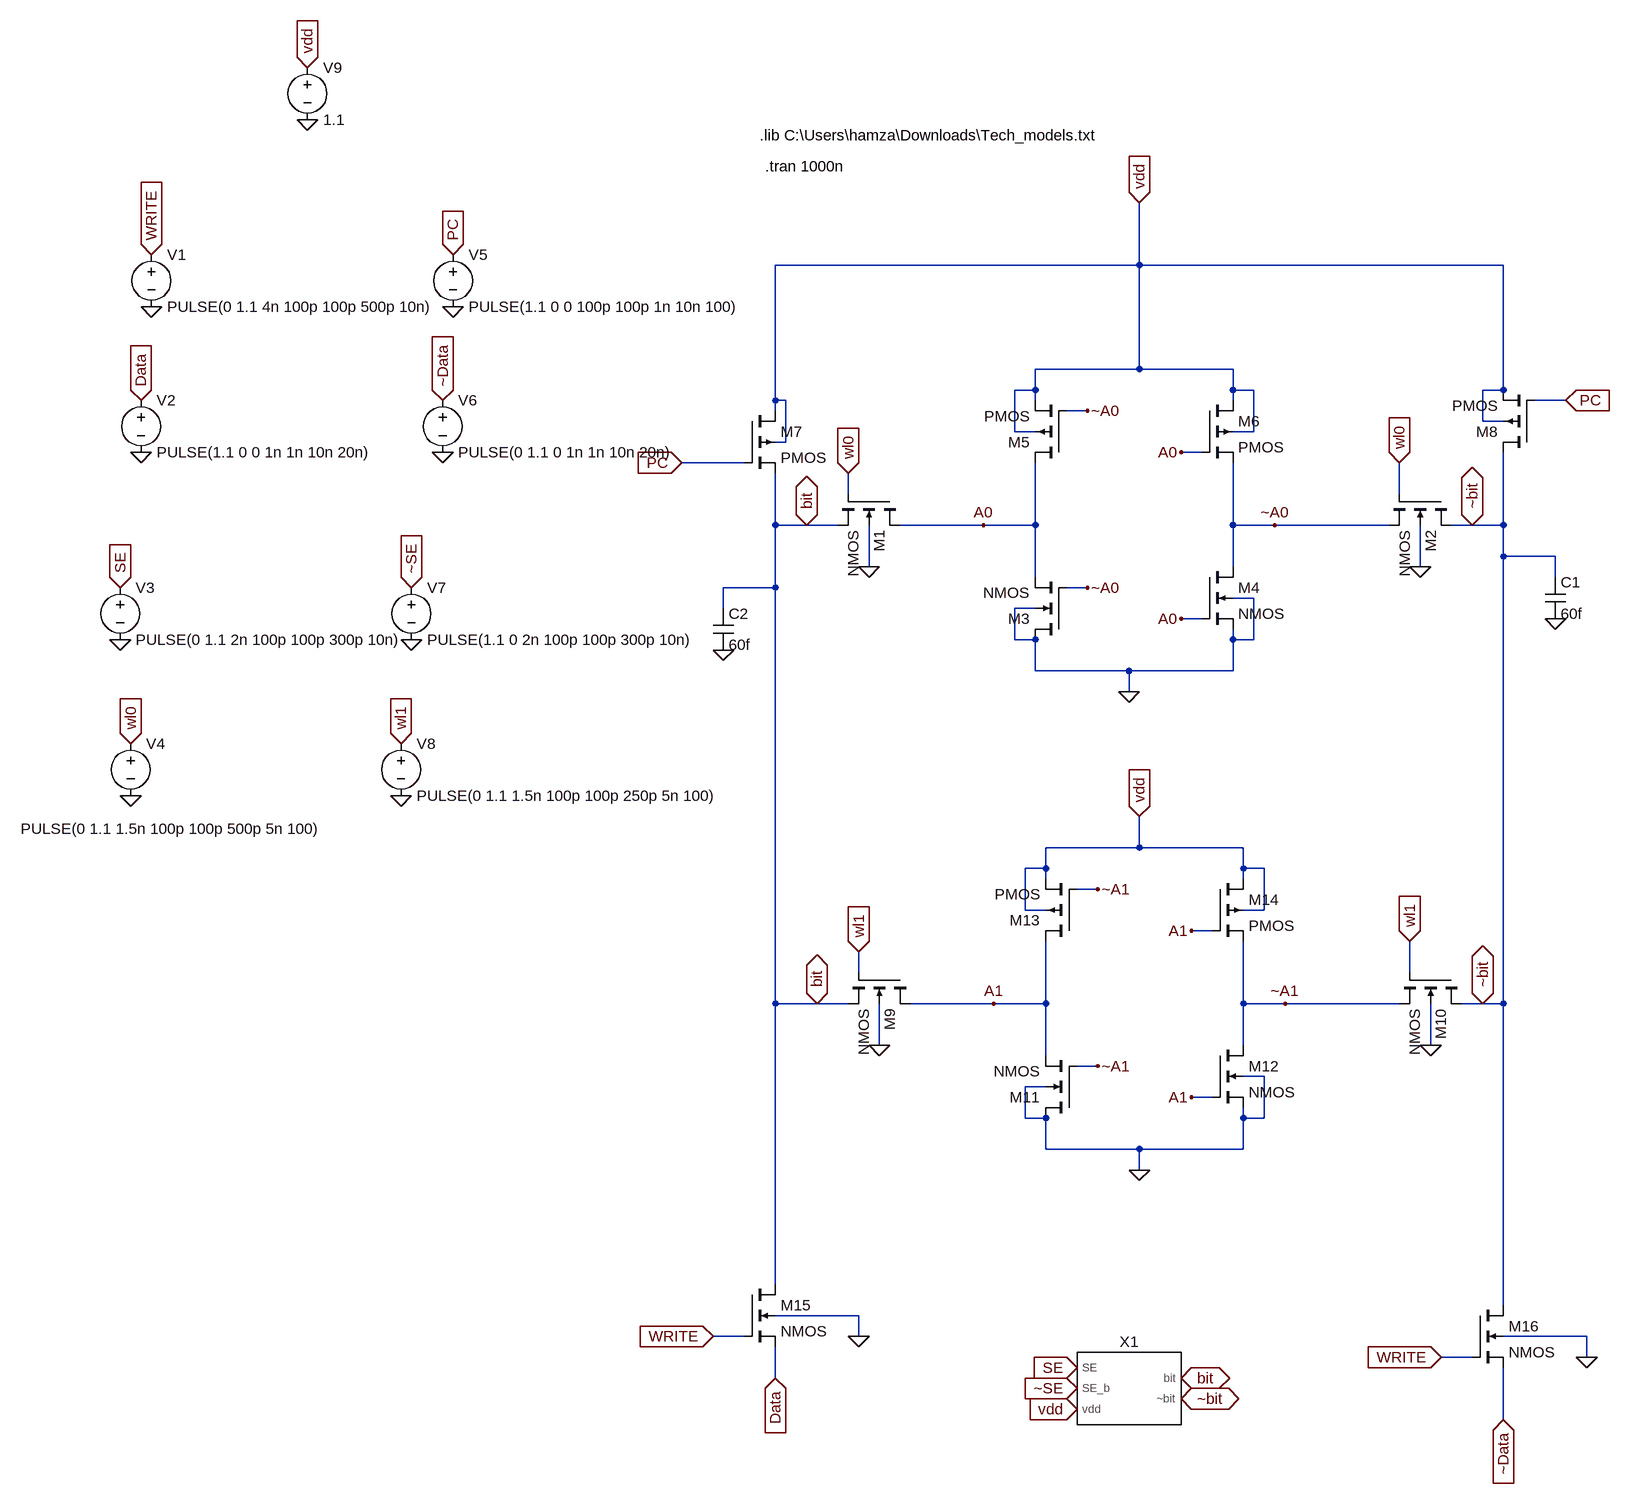
[diagram p0: schematic SRAM_column.asc]
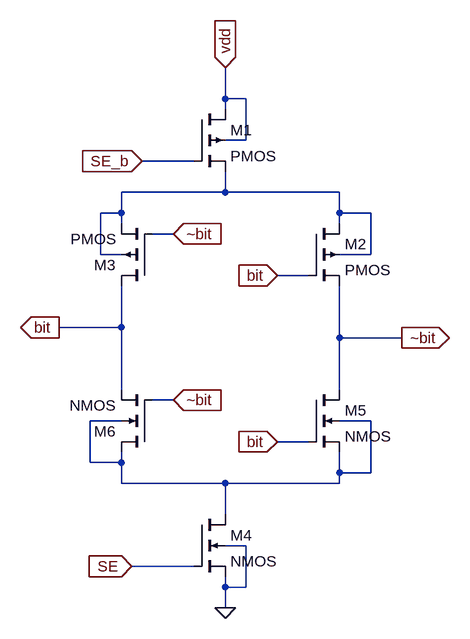
[diagram p1: sub-circuit se.asc]
SRAM_column.asc, the LTspice schematic file:
Version 4
SHEET 1 3236 2020
WIRE 1520 112 1520 16
WIRE 1520 112 960 112
WIRE 2080 112 1520 112
WIRE 1520 272 1520 112
WIRE 1520 272 1360 272
WIRE 1664 272 1520 272
WIRE 1360 304 1360 272
WIRE 1360 304 1328 304
WIRE 1664 304 1664 272
WIRE 1696 304 1664 304
WIRE 2080 304 2080 112
WIRE 2080 304 2048 304
WIRE 960 320 960 112
WIRE 976 320 960 320
WIRE 1360 320 1360 304
WIRE 1664 320 1664 304
WIRE 2176 320 2128 320
WIRE 960 336 960 320
WIRE 1440 336 1408 336
WIRE 2048 352 2048 304
WIRE 2080 352 2048 352
WIRE 1328 368 1328 304
WIRE 1360 368 1328 368
WIRE 1696 368 1696 304
WIRE 1696 368 1664 368
WIRE 976 384 976 320
WIRE 976 384 960 384
WIRE 1616 400 1584 400
WIRE 912 416 816 416
WIRE 1072 464 1072 432
WIRE 1920 464 1920 416
WIRE 960 512 960 432
WIRE 1008 512 960 512
WIRE 1056 512 1008 512
WIRE 1280 512 1152 512
WIRE 1360 512 1360 416
WIRE 1360 512 1280 512
WIRE 1664 512 1664 416
WIRE 1728 512 1664 512
WIRE 1904 512 1728 512
WIRE 2032 512 2000 512
WIRE 2080 512 2080 400
WIRE 2080 512 2032 512
WIRE 2080 560 2080 512
WIRE 2160 560 2080 560
WIRE 1104 576 1104 512
WIRE 1664 576 1664 512
WIRE 1952 576 1952 512
WIRE 1360 592 1360 512
WIRE 2160 592 2160 560
WIRE 960 608 960 512
WIRE 960 608 880 608
WIRE 1440 608 1408 608
WIRE 1696 624 1664 624
WIRE 880 640 880 608
WIRE 1360 640 1328 640
WIRE 1616 656 1584 656
WIRE 1328 688 1328 640
WIRE 1360 688 1328 688
WIRE 1664 688 1664 672
WIRE 1696 688 1696 624
WIRE 1696 688 1664 688
WIRE 1360 736 1360 688
WIRE 1504 736 1360 736
WIRE 1664 736 1664 688
WIRE 1664 736 1504 736
WIRE 1504 768 1504 736
WIRE 1520 1008 1520 960
WIRE 1520 1008 1376 1008
WIRE 1680 1008 1520 1008
WIRE 1376 1040 1376 1008
WIRE 1376 1040 1344 1040
WIRE 1680 1040 1680 1008
WIRE 1712 1040 1680 1040
WIRE 1376 1056 1376 1040
WIRE 1680 1056 1680 1040
WIRE 1456 1072 1424 1072
WIRE 1344 1104 1344 1040
WIRE 1376 1104 1344 1104
WIRE 1712 1104 1712 1040
WIRE 1712 1104 1680 1104
WIRE 1632 1136 1600 1136
WIRE 1088 1200 1088 1168
WIRE 1936 1200 1936 1152
WIRE 960 1248 960 608
WIRE 1024 1248 960 1248
WIRE 1072 1248 1024 1248
WIRE 1296 1248 1168 1248
WIRE 1376 1248 1376 1152
WIRE 1376 1248 1296 1248
WIRE 1680 1248 1680 1152
WIRE 1744 1248 1680 1248
WIRE 1920 1248 1744 1248
WIRE 2048 1248 2016 1248
WIRE 2080 1248 2080 560
WIRE 2080 1248 2048 1248
WIRE 1120 1312 1120 1248
WIRE 1680 1312 1680 1248
WIRE 1968 1312 1968 1248
WIRE 1376 1328 1376 1248
WIRE 1456 1344 1424 1344
WIRE 1712 1360 1680 1360
WIRE 1376 1376 1344 1376
WIRE 1632 1392 1600 1392
WIRE 1344 1424 1344 1376
WIRE 1376 1424 1344 1424
WIRE 1680 1424 1680 1408
WIRE 1712 1424 1712 1360
WIRE 1712 1424 1680 1424
WIRE 1376 1472 1376 1424
WIRE 1520 1472 1376 1472
WIRE 1680 1472 1680 1424
WIRE 1680 1472 1520 1472
WIRE 1520 1504 1520 1472
WIRE 960 1680 960 1248
WIRE 2080 1712 2080 1248
WIRE 1088 1728 960 1728
WIRE 912 1760 864 1760
WIRE 1088 1760 1088 1728
WIRE 2208 1760 2080 1760
WIRE 2032 1792 1984 1792
WIRE 2208 1792 2208 1760
WIRE 960 1824 960 1776
WIRE 2080 1888 2080 1808
FLAG 1728 512 ~A0
FLAG 1280 512 A0
FLAG 1584 400 A0
FLAG 1584 656 A0
FLAG 1440 608 ~A0
FLAG 1440 336 ~A0
FLAG 1072 432 wl0
IOPIN 1072 432 In
FLAG 1920 416 wl0
IOPIN 1920 416 In
FLAG 816 416 PC
IOPIN 816 416 In
FLAG 1008 512 bit
IOPIN 1008 512 BiDir
FLAG 1952 576 0
FLAG 2176 320 PC
IOPIN 2176 320 In
FLAG 1104 576 0
FLAG 2032 512 ~bit
IOPIN 2032 512 BiDir
FLAG 864 1760 WRITE
IOPIN 864 1760 In
FLAG 960 1824 Data
IOPIN 960 1824 In
FLAG 1088 1760 0
FLAG 1984 1792 WRITE
IOPIN 1984 1792 In
FLAG 2080 1888 ~Data
IOPIN 2080 1888 In
FLAG 2208 1792 0
FLAG 880 704 0
FLAG 2160 656 0
FLAG 1504 768 0
FLAG 1520 16 vdd
IOPIN 1520 16 In
FLAG 1744 1248 ~A1
FLAG 1296 1248 A1
FLAG 1600 1136 A1
FLAG 1600 1392 A1
FLAG 1456 1344 ~A1
FLAG 1456 1072 ~A1
FLAG 1088 1168 wl1
IOPIN 1088 1168 In
FLAG 1936 1152 wl1
IOPIN 1936 1152 In
FLAG 1024 1248 bit
IOPIN 1024 1248 BiDir
FLAG 1968 1312 0
FLAG 1120 1312 0
FLAG 2048 1248 ~bit
IOPIN 2048 1248 BiDir
FLAG 1520 1504 0
FLAG 1584 1824 bit
IOPIN 1584 1824 BiDir
FLAG 1584 1856 ~bit
IOPIN 1584 1856 BiDir
FLAG 1424 1808 SE
IOPIN 1424 1808 In
FLAG 1424 1840 ~SE
IOPIN 1424 1840 In
FLAG 1424 1872 vdd
IOPIN 1424 1872 In
FLAG 1520 960 vdd
IOPIN 1520 960 In
FLAG 240 -112 0
FLAG 464 176 0
FLAG 0 176 0
FLAG -16 400 0
FLAG 448 400 0
FLAG 400 688 0
FLAG -48 688 0
FLAG -32 928 0
FLAG 384 928 0
FLAG 0 96 WRITE
IOPIN 0 96 In
FLAG 464 96 PC
IOPIN 464 96 In
FLAG -16 320 Data
IOPIN -16 320 In
FLAG 448 320 ~Data
IOPIN 448 320 In
FLAG -48 608 SE
IOPIN -48 608 In
FLAG 400 608 ~SE
IOPIN 400 608 In
FLAG -32 848 wl0
IOPIN -32 848 In
FLAG 384 848 wl1
IOPIN 384 848 In
FLAG 240 -192 vdd
IOPIN 240 -192 In
SYMBOL nmos4 1152 464 R90
SYMATTR InstName M1
SYMATTR Value2 l=250n w=100n
SYMBOL nmos4 2000 464 R90
SYMATTR InstName M2
SYMATTR Value2 l=250n w=100n
SYMBOL nmos4 1408 688 R180
SYMATTR InstName M3
SYMATTR Value2 l=32n w=64n
SYMBOL nmos4 1616 576 R0
SYMATTR InstName M4
SYMATTR Value2 l=32n w=64n
SYMBOL pmos4 1408 416 R180
SYMATTR InstName M5
SYMATTR Value2 l=250n w=600n
SYMBOL pmos4 1616 320 R0
SYMATTR InstName M6
SYMATTR Value2 l=250n w=600n
SYMBOL pmos4 912 336 R0
SYMATTR InstName M7
SYMATTR Value2 l=32n w=1280n
SYMBOL pmos4 2128 400 R180
SYMATTR InstName M8
SYMATTR Value2 l=32n w=1280n
SYMBOL nmos4 912 1680 R0
SYMATTR InstName M15
SYMATTR Value2 l=32n w=1000n
SYMBOL nmos4 2032 1712 R0
SYMATTR InstName M16
SYMATTR Value2 l=32n w=1000n
SYMBOL cap 2144 592 R0
SYMATTR InstName C1
SYMATTR Value 60f
SYMBOL cap 864 640 R0
SYMATTR InstName C2
SYMATTR Value 60f
SYMBOL nmos4 1168 1200 R90
SYMATTR InstName M9
SYMATTR Value2 l=250n w=100n
SYMBOL nmos4 2016 1200 R90
SYMATTR InstName M10
SYMATTR Value2 l=250n w=100n
SYMBOL nmos4 1424 1424 R180
SYMATTR InstName M11
SYMATTR Value2 l=32n w=64n
SYMBOL nmos4 1632 1312 R0
SYMATTR InstName M12
SYMATTR Value2 l=32n w=64n
SYMBOL pmos4 1424 1152 R180
SYMATTR InstName M13
SYMATTR Value2 l=250n w=600n
SYMBOL pmos4 1632 1056 R0
SYMATTR InstName M14
SYMATTR Value2 l=250n w=600n
SYMBOL se 1504 1840 R0
SYMATTR InstName X1
SYMBOL voltage 0 80 R0
WINDOW 123 0 0 Left 2
WINDOW 39 0 0 Left 2
SYMATTR InstName V1
SYMATTR Value PULSE(0 1.1 4n 100p 100p 500p 10n)
SYMBOL voltage -16 304 R0
WINDOW 123 0 0 Left 2
WINDOW 39 0 0 Left 2
SYMATTR InstName V2
SYMATTR Value PULSE(1.1 0 0 1n 1n 10n 20n)
SYMBOL voltage -48 592 R0
WINDOW 123 0 0 Left 2
WINDOW 39 0 0 Left 2
SYMATTR InstName V3
SYMATTR Value PULSE(0 1.1 2n 100p 100p 300p 10n)
SYMBOL voltage -32 832 R0
WINDOW 3 -169 147 Left 2
WINDOW 123 0 0 Left 2
WINDOW 39 0 0 Left 2
SYMATTR Value PULSE(0 1.1 1.5n 100p 100p 500p 5n 100)
SYMATTR InstName V4
SYMBOL voltage 464 80 R0
WINDOW 123 0 0 Left 2
WINDOW 39 0 0 Left 2
SYMATTR InstName V5
SYMATTR Value PULSE(1.1 0 0 100p 100p 1n 10n 100)
SYMBOL voltage 448 304 R0
WINDOW 123 0 0 Left 2
WINDOW 39 0 0 Left 2
SYMATTR InstName V6
SYMATTR Value PULSE(0 1.1 0 1n 1n 10n 20n)
SYMBOL voltage 400 592 R0
WINDOW 123 0 0 Left 2
WINDOW 39 0 0 Left 2
SYMATTR InstName V7
SYMATTR Value PULSE(1.1 0 2n 100p 100p 300p 10n)
SYMBOL voltage 384 832 R0
WINDOW 123 0 0 Left 2
WINDOW 39 0 0 Left 2
SYMATTR InstName V8
SYMATTR Value PULSE(0 1.1 1.5n 100p 100p 250p 5n 100)
SYMBOL voltage 240 -208 R0
WINDOW 123 0 0 Left 2
WINDOW 39 0 0 Left 2
SYMATTR InstName V9
SYMATTR Value 1.1
TEXT 936 -88 Left 2 !.lib C:\\Users\\hamza\\Downloads\\Tech_models.txt
TEXT 944 -40 Left 2 !.tran 1000n

se.asc, the sub-circuit schematic file:
Version 4
SHEET 1 880 868
WIRE 208 64 208 16
WIRE 240 64 208 64
WIRE 208 80 208 64
WIRE 240 128 240 64
WIRE 240 128 208 128
WIRE 160 160 80 160
WIRE 208 208 208 176
WIRE 208 208 48 208
WIRE 384 208 208 208
WIRE 48 240 48 208
WIRE 48 240 16 240
WIRE 384 240 384 208
WIRE 432 240 384 240
WIRE 48 256 48 240
WIRE 384 256 384 240
WIRE 128 272 96 272
WIRE 16 304 16 240
WIRE 48 304 16 304
WIRE 432 304 432 240
WIRE 432 304 384 304
WIRE 336 336 288 336
WIRE 48 416 48 352
WIRE 48 416 -48 416
WIRE 384 432 384 352
WIRE 480 432 384 432
WIRE 48 512 48 416
WIRE 384 512 384 432
WIRE 128 528 96 528
WIRE 48 560 0 560
WIRE 432 560 384 560
WIRE 336 592 288 592
WIRE 0 624 0 560
WIRE 48 624 48 608
WIRE 48 624 0 624
WIRE 384 640 384 608
WIRE 432 640 432 560
WIRE 432 640 384 640
WIRE 48 656 48 624
WIRE 208 656 48 656
WIRE 384 656 384 640
WIRE 384 656 208 656
WIRE 208 704 208 656
WIRE 240 752 208 752
WIRE 160 784 64 784
WIRE 208 816 208 800
WIRE 240 816 240 752
WIRE 240 816 208 816
WIRE 208 848 208 816
FLAG 208 16 vdd
IOPIN 208 16 In
FLAG 80 160 SE_b
IOPIN 80 160 In
FLAG 288 336 bit
IOPIN 288 336 In
FLAG 288 592 bit
IOPIN 288 592 In
FLAG 128 272 ~bit
IOPIN 128 272 In
FLAG 128 528 ~bit
IOPIN 128 528 In
FLAG -48 416 bit
IOPIN -48 416 Out
FLAG 480 432 ~bit
IOPIN 480 432 Out
FLAG 208 848 0
FLAG 64 784 SE
IOPIN 64 784 In
SYMBOL pmos4 160 80 R0
SYMATTR InstName M1
SYMATTR Value2 l=32n w=640n
SYMBOL pmos4 336 256 R0
SYMATTR InstName M2
SYMATTR Value2 l=32n w=64n
SYMBOL pmos4 96 352 R180
SYMATTR InstName M3
SYMATTR Value2 l=32n w=64n
SYMBOL nmos4 160 704 R0
SYMATTR InstName M4
SYMATTR Value2 l=32n w=640n
SYMBOL nmos4 336 512 R0
SYMATTR InstName M5
SYMATTR Value2 l=32n w=640n
SYMBOL nmos4 96 608 R180
SYMATTR InstName M6
SYMATTR Value2 l=32n w=640n

The netlist it stands for:
* SRAM_column.asc
M1 A0 wl0 bit 0 NMOS l=250n w=100n
M2 ~bit wl0 ~A0 0 NMOS l=250n w=100n
M3 0 ~A0 A0 0 NMOS l=32n w=64n
M4 ~A0 A0 0 0 NMOS l=32n w=64n
M5 A0 ~A0 vdd vdd PMOS l=250n w=600n
M6 vdd A0 ~A0 vdd PMOS l=250n w=600n
M7 vdd PC bit vdd PMOS l=32n w=1280n
M8 ~bit PC vdd vdd PMOS l=32n w=1280n
M15 bit WRITE Data 0 NMOS l=32n w=1000n
M16 ~bit WRITE ~Data 0 NMOS l=32n w=1000n
C1 ~bit 0 60f
C2 bit 0 60f
M9 A1 wl1 bit 0 NMOS l=250n w=100n
M10 ~bit wl1 ~A1 0 NMOS l=250n w=100n
M11 0 ~A1 A1 0 NMOS l=32n w=64n
M12 ~A1 A1 0 0 NMOS l=32n w=64n
M13 A1 ~A1 vdd vdd PMOS l=250n w=600n
M14 vdd A1 ~A1 vdd PMOS l=250n w=600n
XX1 SE ~SE vdd bit ~bit se
V1 WRITE 0 PULSE(0 1.1 4n 100p 100p 500p 10n)
V2 Data 0 PULSE(1.1 0 0 1n 1n 10n 20n)
V3 SE 0 PULSE(0 1.1 2n 100p 100p 300p 10n)
V4 wl0 0 PULSE(0 1.1 1.5n 100p 100p 500p 5n 100)
V5 PC 0 PULSE(1.1 0 0 100p 100p 1n 10n 100)
V6 ~Data 0 PULSE(0 1.1 0 1n 1n 10n 20n)
V7 ~SE 0 PULSE(1.1 0 2n 100p 100p 300p 10n)
V8 wl1 0 PULSE(0 1.1 1.5n 100p 100p 250p 5n 100)
V9 vdd 0 1.1

* block symbol definitions
.subckt se SE SE_b vdd bit ~bit
M1 vdd SE_b N001 vdd PMOS l=32n w=640n
M2 N001 bit ~bit N001 PMOS l=32n w=64n
M3 bit ~bit N001 N001 PMOS l=32n w=64n
M4 N002 SE 0 0 NMOS l=32n w=640n
M5 ~bit bit N002 N002 NMOS l=32n w=640n
M6 N002 ~bit bit N002 NMOS l=32n w=640n
.ends se

.model NMOS NMOS
.model PMOS PMOS
.lib standard.mos
.lib C:\Users\hamza\Downloads\Tech_models.txt
.tran 1000n
.backanno
.end